# Altium schematic sheet MSXII-Controller-Breakout.SchDoc
size Letter; Website: www.uwmidsun.com
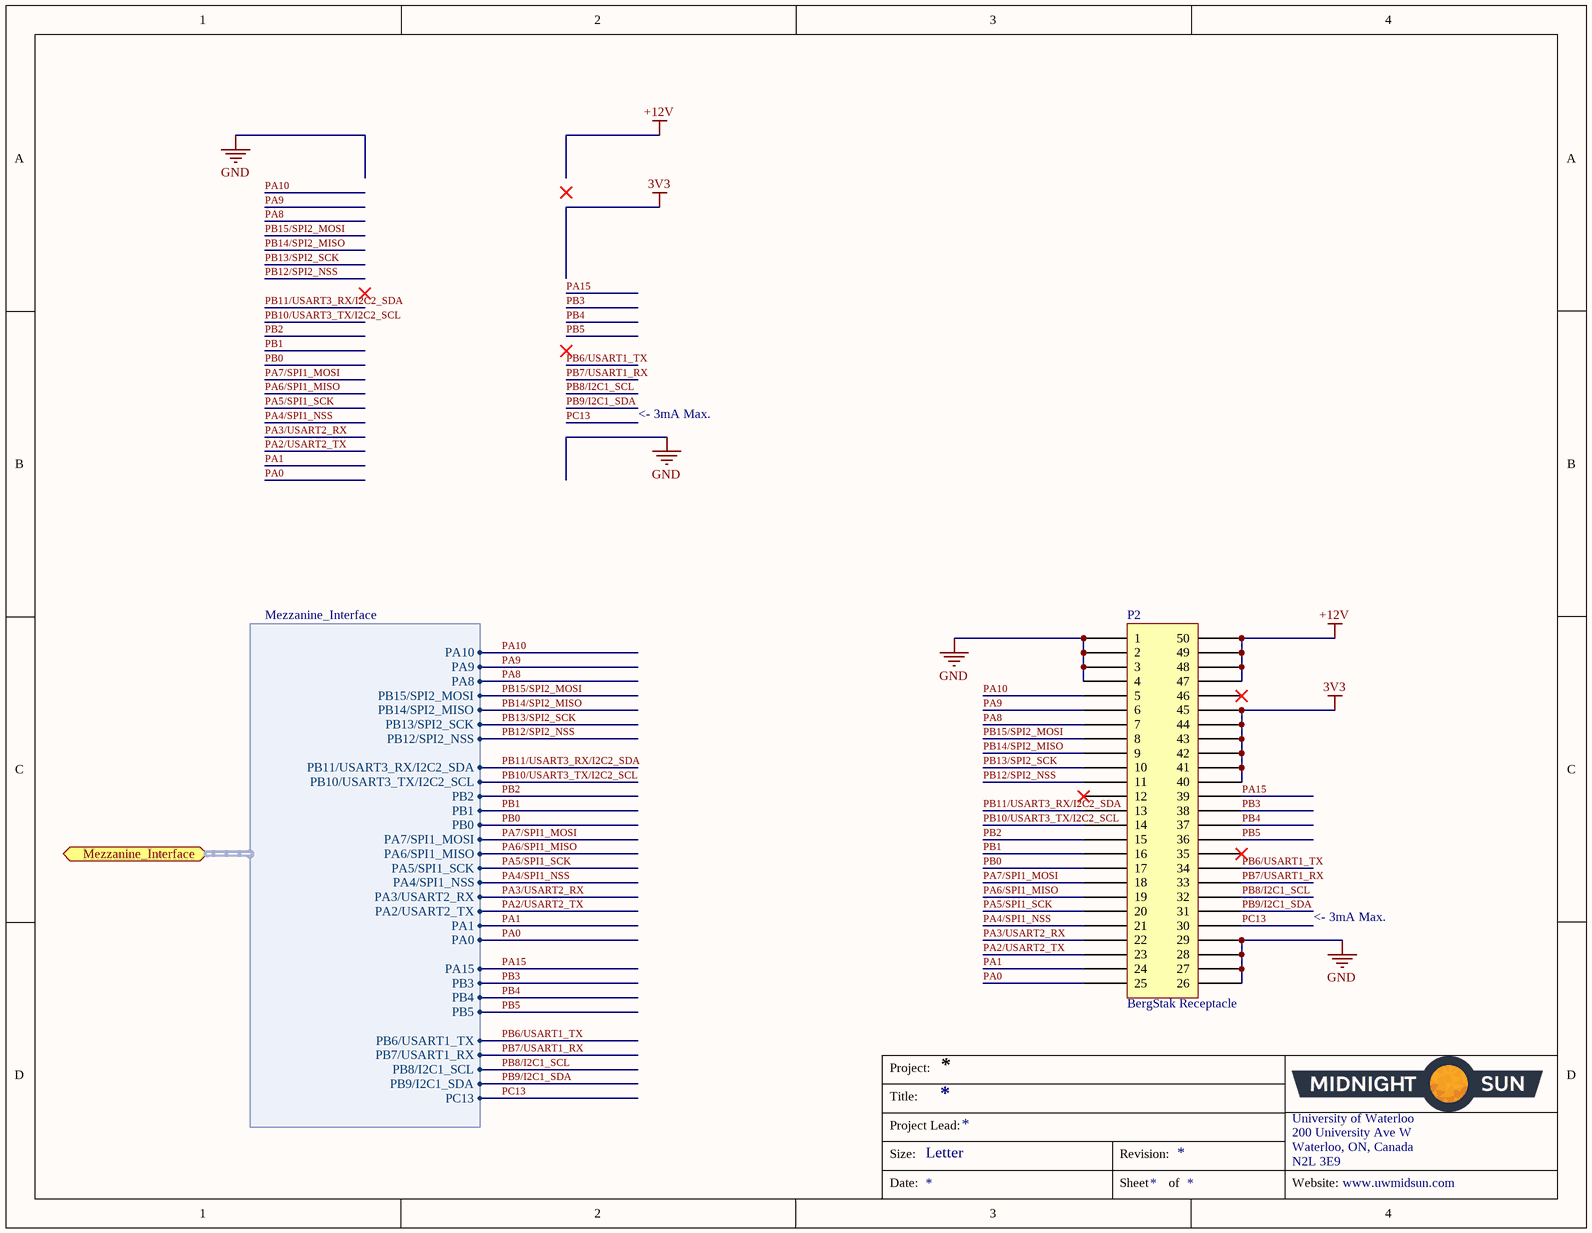
[diagram p0: MSXII-Controller-Breakout.SchDoc]

## Parts
P2  BergStak Receptacle  [Bergstak 50 Pos Receptacle]

## Ports
Mezzanine_Interface (harness Mezzanine_Interface)

## Harnesses
Mezzanine_Interface: PA10, PA9, PA8, PB15/SPI2_MOSI, PB14/SPI2_MISO, PB13/SPI2_SCK, PB12/SPI2_NSS, PB11/USART3_RX/I2C2_SDA, PB10/USART3_TX/I2C2_SCL, PB2, PB1, PB0, PA7/SPI1_MOSI, PA6/SPI1_MISO, PA5/SPI1_SCK, PA4/SPI1_NSS, PA3/USART2_RX, PA2/USART2_TX, PA1, PA0, PA15, PB3, PB4, PB5, PB6/USART1_TX, PB7/USART1_RX, PB8/I2C1_SCL, PB9/I2C1_SDA, PC13

## Nets
3V3: P2.40 P2.41 P2.42 P2.43 P2.44 P2.45
+12V: P2.47 P2.48 P2.49 P2.50
GND: P2.1 P2.2 P2.3 P2.4 P2.26 P2.27 P2.28 P2.29
PA0: P2.25 ; port Mezzanine_Interface.PA0
PA1: P2.24 ; port Mezzanine_Interface.PA1
PA2/USART2_TX: P2.23 ; port Mezzanine_Interface.PA2/USART2_TX
PA3/USART2_RX: P2.22 ; port Mezzanine_Interface.PA3/USART2_RX
PA4/SPI1_NSS: P2.21 ; port Mezzanine_Interface.PA4/SPI1_NSS
PA5/SPI1_SCK: P2.20 ; port Mezzanine_Interface.PA5/SPI1_SCK
PA6/SPI1_MISO: P2.19 ; port Mezzanine_Interface.PA6/SPI1_MISO
PA7/SPI1_MOSI: P2.18 ; port Mezzanine_Interface.PA7/SPI1_MOSI
PA8: P2.7 ; port Mezzanine_Interface.PA8
PA9: P2.6 ; port Mezzanine_Interface.PA9
PA10: P2.5 ; port Mezzanine_Interface.PA10
PA15: P2.39 ; port Mezzanine_Interface.PA15
PB0: P2.17 ; port Mezzanine_Interface.PB0
PB1: P2.16 ; port Mezzanine_Interface.PB1
PB2: P2.15 ; port Mezzanine_Interface.PB2
PB3: P2.38 ; port Mezzanine_Interface.PB3
PB4: P2.37 ; port Mezzanine_Interface.PB4
PB5: P2.36 ; port Mezzanine_Interface.PB5
PB6/USART1_TX: P2.34 ; port Mezzanine_Interface.PB6/USART1_TX
PB7/USART1_RX: P2.33 ; port Mezzanine_Interface.PB7/USART1_RX
PB8/I2C1_SCL: P2.32 ; port Mezzanine_Interface.PB8/I2C1_SCL
PB9/I2C1_SDA: P2.31 ; port Mezzanine_Interface.PB9/I2C1_SDA
PB10/USART3_TX/I2C2_SCL: P2.14 ; port Mezzanine_Interface.PB10/USART3_TX/I2C2_SCL
PB11/USART3_RX/I2C2_SDA: P2.13 ; port Mezzanine_Interface.PB11/USART3_RX/I2C2_SDA
PB12/SPI2_NSS: P2.11 ; port Mezzanine_Interface.PB12/SPI2_NSS
PB13/SPI2_SCK: P2.10 ; port Mezzanine_Interface.PB13/SPI2_SCK
PB14/SPI2_MISO: P2.9 ; port Mezzanine_Interface.PB14/SPI2_MISO
PB15/SPI2_MOSI: P2.8 ; port Mezzanine_Interface.PB15/SPI2_MOSI
PC13: P2.30 ; port Mezzanine_Interface.PC13

Not connected (* = marked no-connect by the designer): P2 12* 35* 46*

## Notes on the sheet
- <- 3mA Max.
- Project:
- Title:
- Size:
- Project Lead:
- Letter
- Revision:
- University of Waterloo
- 200 University Ave W
- Waterloo, ON, Canada
- N2L 3E9
- Date:
- Sheet
- of
- Website:

## Library data of the parts
P2 = BergStak 50 Position Connector Receptacle: 50 Position Connector Receptacle, Center Strip Contacts Surface Mount Gold; Manufacturer Part Number: 10132798-052100LF; Digikey Part Number: 609-5227-1-ND; Supplier 1: Digi-Key; Supplier Part Number 1: 609-5227-1-ND